# EasyEDA Pro project ProPrj_PW113_RF功放_2025-07-16.epro

# Schematic Schematic1
Board Name: Board1; Create Date: 2025-07-15; Page Name: P1; Project Name: PW113_RF功放; Schematic Name: Schematic1; Update Date: 2025-07-15; Company: 嘉立创EDA; Page Size: A4; Version: V1.0
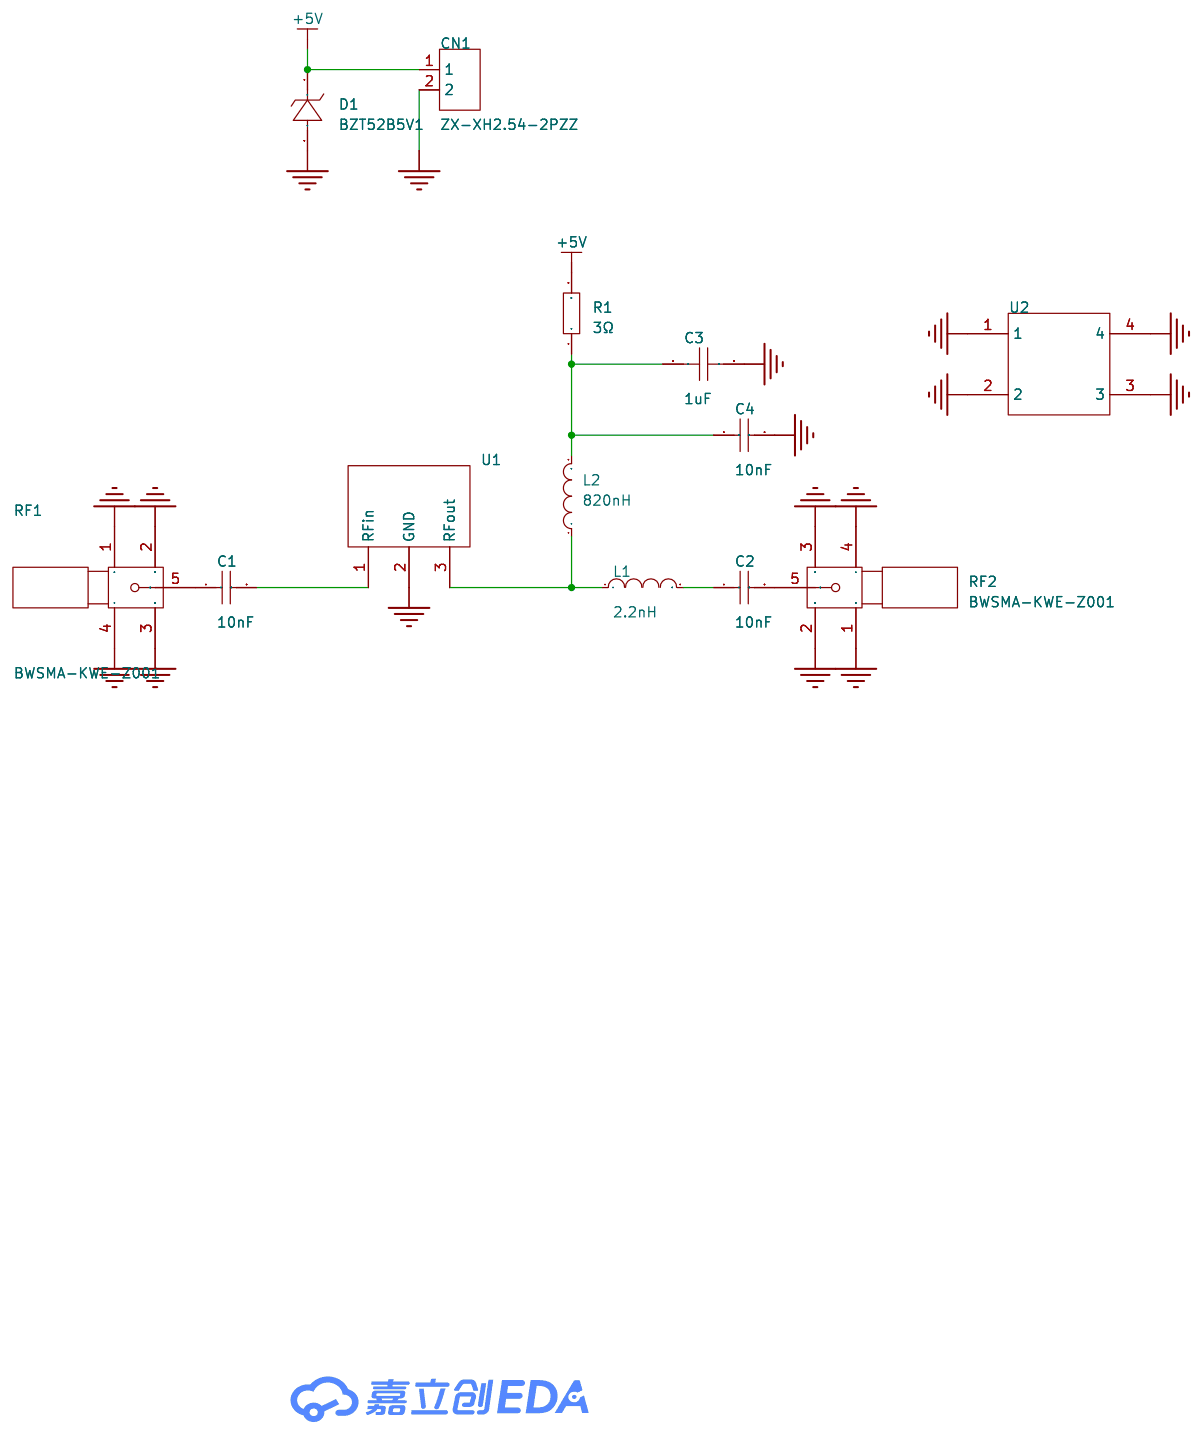
[diagram p0: schematic sheet]

## Parts
C1  10nF  [C0603]
C2  10nF  [C0603]
C3  1uF  [C0603]
C4  10nF  [C0603]
CN1  ZX-XH2.54-2PZZ  [CONN-TH_2P-P2.50_HX25003-2A]
D1  BZT52B5V1  [SOD-123_L2.7-W1.6-LS3.7-RD]
L1  2.2nH  [IND-SMD_L1.6-W1.0]
L2  820nH  [L0603]
R1  3Ω  [R0805]
RF1  BWSMA-KWE-Z001  [SMA-TH_BWSMA-KWE-Z001]
RF2  BWSMA-KWE-Z001  [SMA-TH_BWSMA-KWE-Z001]
U1  -  [PG-SOT-89-4_L4.5-W2.5-P1.50-LS4.2-TR]
U2  -  [22x17x6]

## Library data of the parts
C1 C2 C4 = 0603B103K500NT: 容值:10nF;精度:±10%;额定电压:50V;温度系数:X7R;; LCSC Part Name: 10nF ±10% 50V; Supplier Part: C57112; Manufacturer: FH(风华); Supplier Footprint: 0603; JLCPCB Part Class: 基础库; Datasheet: https://atta.szlcsc.com/upload/public/pdf/source/20200305/C486355_26A10D38EF8C2A5C37091D0039909270.pdf; Supplier: LCSC; Tolerance: ±10%; Voltage Rating: 50V; Temperature Coefficient: X7R
C3 = CL10A105KB8NNNC: 容值:1uF;精度:±10%;额定电压:50V;材质(温度系数):X5R;; LCSC Part Name: 1uF ±10% 50V; Supplier Part: C15849; Manufacturer: SAMSUNG(三星); Supplier Footprint: 0603; JLCPCB Part Class: 基础库; Datasheet: https://atta.szlcsc.com/upload/public/pdf/source/20160218/1457707763339.pdf; Supplier: LCSC; Tolerance: ±10%; Voltage Rated: 50V; Temperature Coefficient: X5R
CN1 = ZX-XH2.54-2PZZ: 插针结构:1x2P;间距:2.5mm;安装方式:直插;参考系列:XH;总PIN数:2P;排数:1;每排PIN数:2;行距:-;额定电流:3A;触头材质:黄铜;触头镀层:锡;工作温度:-25℃~+85℃;; LCSC Part Name: 1x2P 间距:2.5mm 直插 系列:XH; Supplier Part: C7429632; Manufacturer: Megastar(兆星); Supplier Footprint: 插件,P=2.5mm; JLCPCB Part Class: 扩展库; Datasheet: https://atta.szlcsc.com/upload/public/pdf/source/20230619/19BA6947230AA44A04D3EDD65E618FD0.pdf; Supplier: LCSC; Pins Structure: 1x2P; Pitch: 2.5mm; Mounting Type: 直插; Reference Series: XH; Number of Pins: 2P; Number of Rows: 1; Number of PINs Per Row: 2; Current Rating: 3A; Contact Material: 黄铜; Contact Plating: 锡; Operating Temperature: -25℃~+85℃; Voltage Rating: 250V; Plastic Material: PA66; Flame Retardant Rating: UL94V-0; Color: 白色; Z-Height of the Board: 7mm; X-Length of Bottom Edge on Board (Spacing Line): 7.5mm; Y-Width of Bottom Edge on Board: 5.9mm
D1 = BZT52B5V1_C19077393: 二极管配置:独立式;稳压值(标称值):5.1V;稳压值(范围):5V~5.2V;耗散功率(Pd):500mW;; Supplier Part: C19077393; Manufacturer: 宏嘉诚; Supplier Footprint: SOD-123; JLCPCB Part Class: 扩展库; Datasheet: https://atta.szlcsc.com/upload/public/pdf/source/20250106/AFD01FE5B0C707EDCEE558C585303F64.pdf; Supplier: LCSC; Diode Configuration: 独立式; Zener Voltage(Nom): 5.1V; Reverse Leakage Current (Ir): 2uA@2V; Zener Voltage(Range): 5V~5.2V; Pd - Power Dissipation(Pd): 500mW; Impedance(Zzt): 60Ω
L1 = CS0603-2N2J-S: 电感值:2.2nH;精度:±5%;额定电流:700mA;饱和电流(Isat):-;直流电阻(DCR):250mΩ;; LCSC Part Name: 2.2nH ±5%; Supplier Part: C280268; Manufacturer: Chilisin(奇力新); Supplier Footprint: 0603; JLCPCB Part Class: 扩展库; Datasheet: https://atta.szlcsc.com/upload/public/pdf/source/20181015/C280283_399428C6A5E6C348F06CEC39677678EB.pdf; Supplier: LCSC; Tolerance: ±5%; Current Rating: 700mA; DC Resistance(DCR): 250mΩ; Q @ Frequency: 13@250MHz; Frequency - Self Resonant: 12.5GHz
L2 = MLF1608DR82JTD25: 电感值:820nH;精度:±5%;额定电流:70mA;饱和电流(Isat):-;直流电阻(DCR):750mΩ;; LCSC Part Name: 820nH ±5%; Supplier Part: C404520; Manufacturer: TDK; Supplier Footprint: 0603; JLCPCB Part Class: 扩展库; Datasheet: https://atta.szlcsc.com/upload/public/pdf/source/20190315/C380006_40E8C92C81D7F1F4B5C2A9461469A58E.pdf; Supplier: LCSC; Tolerance: ±5%; Rated Current: 70mA; DC Resistance (DCR): 750mΩ; Q @ Freq: 15@25MHz; Frequency - Self Resonant: 130MHz; Ratings: AEC-Q200; Type: 叠层电感
R1 = 0805W8F300KT5E: 电阻类型:厚膜电阻;阻值:3Ω;精度:±1%;功率:125mW;工作电压:150V;温度系数:±400ppm/℃;; LCSC Part Name: 3Ω ±1% 125mW 厚膜电阻; Supplier Part: C17660; Manufacturer: UNI-ROYAL(厚声); Supplier Footprint: 0805; JLCPCB Part Class: 扩展库; Datasheet: https://atta.szlcsc.com/upload/public/pdf/source/20200306/C422600_1E6D84923E4A46A82E41ADD87F860B5C.pdf; Supplier: LCSC; Type: 厚膜电阻; Tolerance: ±1%; Power(Watts): 125mW; Voltage-Supply(Max): 150V; Temperature Coefficient: ±400ppm/℃; Operating Temperature: -55℃~+155℃
RF1 RF2 = BWSMA-KWE-Z001: 连接器类型:板端;接口类型:内孔;端口数量:1;接口直径:5.3mm;接口长度/高度:-;频率-最大值:-;射频系列:SMA;阻抗:50Ω;样式:弯头;触头材质:-;触头镀层:-;工作温度范围:-;焊接温度(最大值):-;; LCSC Part Name: 内孔 SMA 弯头; Supplier Part: C496551; Manufacturer: BAT WIRELESS(蝙蝠无线); Supplier Footprint: 插件; JLCPCB Part Class: 扩展库; Datasheet: https://atta.szlcsc.com/upload/public/pdf/source/20231017/997A8C2ADA7F8034A89BE1264F38CE52.pdf; Supplier: LCSC; Connector Type: 板端; Interface Type: 内孔; Number of Ports: 1; Interface Diameter: 5.3mm; RF Series: SMA; Impedance: 50Ω; Style: 弯头
U1 = PW113: 功放
U2 = 22x17x6

## Nets
+5V: CN1.1 D1.1(K) R1.2
GND: C3.2 C4.2 CN1.2 D1.2(A) RF1.1 RF1.2 RF1.3 RF1.4 RF2.1 RF2.2 RF2.3 RF2.4 U1.2(GND) U2.1 U2.2 U2.3 U2.4
Net-(C1-1): C1.1 RF1.5
Net-(C1-2): C1.2 U1.1(RFin)
Net-(C2-1): C2.1 L1.2
Net-(C2-2): C2.2 RF2.5
Net-(C3-1): C3.1 C4.1 L2.2 R1.1
Net-(L1-1): L1.1 L2.1 U1.3(RFout)

# Board PCB1
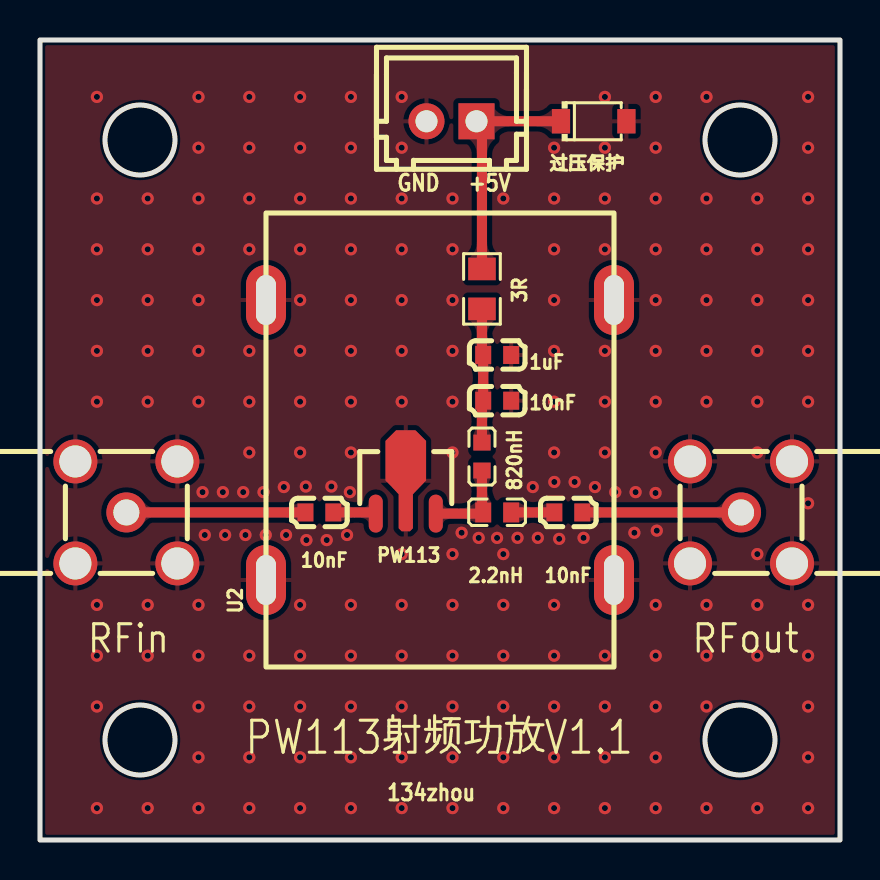
[diagram p1: board, top side]
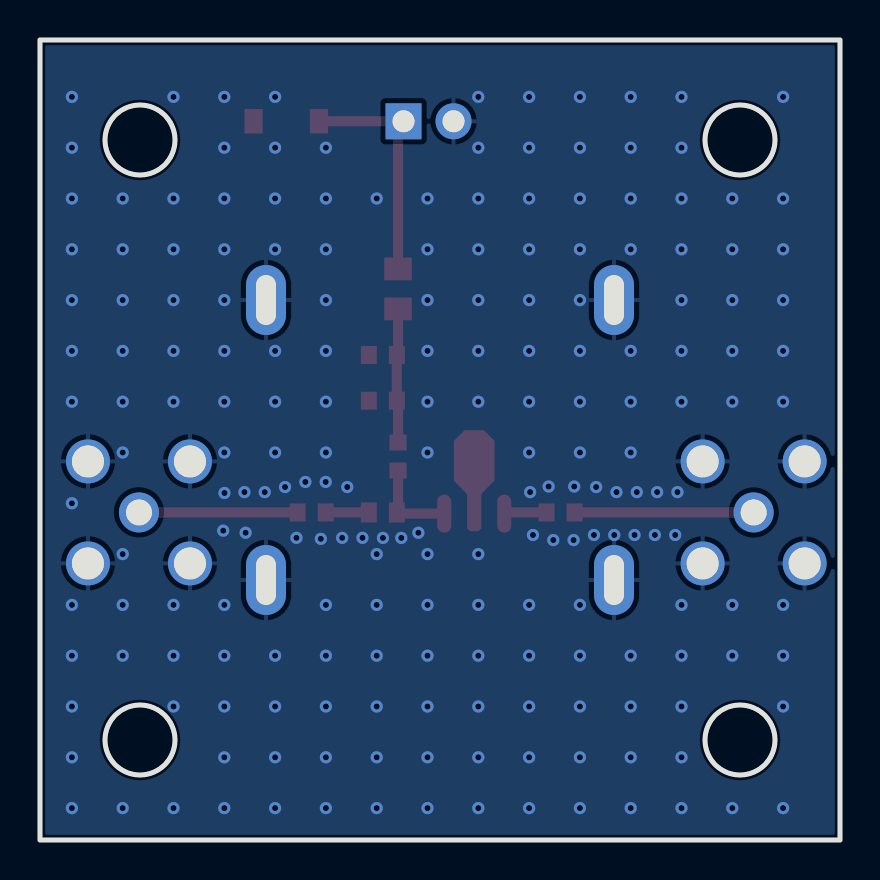
[diagram p2: board, bottom side, seen from below]

Outline 40 x 40 mm; copper layers: Top Layer, Bottom Layer. Coordinates in mm from the lower left corner of the outline.
Outline path: rectangle 0,40 40,0 ; circle c5,35 r1.75 ; circle c5,5 r1.75 ; circle c35,35 r1.75 ; circle c35,5 r1.75
Stack: Top Layer 0.035mm / Dielectric1 1.51mm FR4 er 4.5 / Bottom Layer 0.035mm

## Design rules (mm)
template: JLCPCB Capability(Two Layers Board)
spacing copperThickness1oz (default): track to track 0.102, other pairs 0.152 to 0.3
spacing copperThickness2oz: track to track 0.203, other pairs 0.152 to 0.3
track width copperThickness1oz (default): min 0.127, default 0.254, max 2.54
track width copperThickness2oz: min 0.203, default 0.254, max 2.54
differential pair differentialPair (default): width min 0.127, default 0.254, max 2.54; gap min 0.152, default 0.152
via viaSize (default): diameter min 0.5, default 0.61, max 10; hole min 0.3, default 0.305, max 6.3

## Placement (name value [footprint] x y rotation side)
1uF  1uF  [C0603]  22.86 24.25 0 top
2.2nH  2.2nH  [IND-SMD_L1.6-W1.0]  22.86 16.38 0 top
3R  3Ω  [R0805]  22.1 27.55 90 top
10nF  -  [C0603]  13.97 16.38 0 top
10nF#2  -  [C0603]  26.42 16.38 0 top
10nF#3  -  [C0603]  22.86 21.97 0 top
820nH  820nH  [L0603]  22.1 19.17 90 top
CN1  ZX-XH2.54-2PZZ  [CONN-TH_2P-P2.50_HX25003-2A]  20.57 35.94 180 top
PW113  -  [PG-SOT-89-4_L4.5-W2.5-P1.50-LS4.2-TR]  18.29 17.14 180 top
RFin  BWSMA-KWE-Z001  [SMA-TH_BWSMA-KWE-Z001]  4.32 16.38 180 top
RFout  BWSMA-KWE-Z001  [SMA-TH_BWSMA-KWE-Z001]  35.05 16.38 0 top
U2  -  [22x17x6]  20 20 90 top
过压保护  BZT52B5V1  [SOD-123_L2.7-W1.6-LS3.7-RD]  27.69 35.94 0 top

## Footprints (pads in the part's own frame, mm; a bottom-side part is the same pattern mirrored in y, then rotated)
22x17x6
  oval 3.5x2 hole 2.5x1: 1(-7,-8.7) 2(7,-8.7) 3(7,8.7) 4(-7,8.7)
C0603
  rect 0.8x0.9 smd: 1(-0.7,0) 2(0.7,0)
CONN-TH_2P-P2.50_HX25003-2A
  rect 1.8x1.8 hole 1.1: 1(-1.25,0)
  round 1.8 hole 1.1: 2(1.25,0)
IND-SMD_L1.6-W1.0
  rect 0.8x1 smd: 1(-0.7,0) 2(0.7,0)
L0603
  rect 0.8x0.864 smd: 1(-0.7,0) 2(0.7,0)
PG-SOT-89-4_L4.5-W2.5-P1.50-LS4.2-TR
  oval 0.7x1.9 smd: 1(1.501,0.82) 3(-1.501,0.82)
  custom 2.032x5.055 smd: 2(-0.001,-0.82)
R0805
  rect 1.133x1.377 smd: 1(-1,0) 2(1,0)
SMA-TH_BWSMA-KWE-Z001
  round 2.2 hole 1.6: 1(-2.55,-2.55) 2(-2.55,2.55) 3(2.55,2.55) 4(2.55,-2.55)
  round 2 hole 1.3: 5(0,0)
SOD-123_L2.7-W1.6-LS3.7-RD
  rect 0.91x1.22 smd: 1(-1.635,0) 2(1.635,0)

## Nets
+5V: 3R.2 CN1.1 过压保护.1
GND: 1uF.2 10nF#3.2 CN1.2 PW113.2 RFin.1 RFin.2 RFin.3 RFin.4 RFout.1 RFout.2 RFout.3 RFout.4 U2.1 U2.2 U2.3 U2.4 过压保护.2
$1N333: 10nF.2 PW113.1
$1N443: 2.2nH.2 10nF#2.1
$1N483: 2.2nH.1 820nH.1 PW113.3
$1N524: 1uF.1 3R.1 10nF#3.1 820nH.2
$1N920: 10nF.1 RFin.5
$1N974: 10nF#2.2 RFout.5

## Via types
v1: diameter 0.61, hole 0.305, Top Layer to Bottom Layer, 200 vias

## Routing (per net, layer and track width the routed paths; a pad name or vN(x,y) marks a point on that pad's centre or on a via; arc(x,y) is an arc through that point)
+5V: length 11.7
  Top Layer w0.508: 3R.2 22.1,35.66 CN1.1 过压保护.1
GND:
  vias: v1(2.84,37.16) v1(2.84,32.08) v1(2.84,29.53) v1(2.84,27) v1(2.84,24.45) v1(2.84,21.92) v1(2.84,11.75) v1(2.84,9.22) v1(2.84,6.67) v1(2.84,1.59) v1(5.38,32.08) v1(5.38,29.53) v1(5.38,27) v1(5.38,24.45) v1(5.38,21.92) v1(5.38,11.75) v1(5.38,9.22) v1(5.38,1.59) v1(7.93,37.16) v1(7.93,34.61) v1(7.93,32.08) v1(7.93,29.53) v1(7.93,27) v1(7.93,24.45) v1(7.93,21.92) v1(7.93,11.75) v1(7.93,9.22) v1(7.93,6.67) v1(7.93,4.14) v1(7.93,1.59) v1(8.13,17.39) v1(8.24,15.25) v1(9.14,17.39) v1(9.26,15.25) v1(10.16,17.39) v1(10.27,15.25) v1(10.47,37.16) v1(10.47,34.61) v1(10.47,32.08) v1(10.47,29.53) v1(10.47,24.45) v1(10.47,21.92) v1(10.47,19.38) v1(10.47,9.22) v1(10.47,6.67) v1(10.47,4.14) v1(10.47,1.59) v1(11.18,17.39) v1(11.29,15.25) v1(12.19,17.65) v1(12.3,15.25) v1(13,37.16) v1(13,34.61) v1(13,32.08) v1(13,29.53) v1(13,27) v1(13,24.45) v1(13,21.92) v1(13,19.38) v1(13,11.75) v1(13,9.22) v1(13,6.67) v1(13,4.14) v1(13,1.59) v1(13.29,17.67) v1(13.32,15) v1(14.34,15) v1(14.57,17.67) v1(15.35,15.25) v1(15.54,37.16) v1(15.54,34.61) v1(15.54,32.08) v1(15.54,29.53) v1(15.54,27) v1(15.54,24.45) v1(15.54,21.92) v1(15.54,19.38) v1(15.49,17.39) v1(15.54,11.75) v1(15.54,9.22) v1(15.54,6.67) v1(15.54,4.14) v1(15.54,1.59) v1(18.09,37.16) v1(18.09,34.61) v1(18.09,32.08) v1(18.09,29.53) v1(18.09,27) v1(18.09,24.45) v1(18.09,21.92) v1(18.09,14.3) v1(18.09,11.75) v1(18.09,9.22) v1(18.09,6.67) v1(18.09,4.14) v1(18.09,1.59) v1(20.62,32.08) v1(20.62,29.53) v1(20.62,27) v1(20.62,24.45) v1(20.62,21.92) v1(20.62,19.38) v1(20.62,14.3) v1(20.62,11.75) v1(20.62,9.22) v1(20.62,6.67) v1(20.62,4.14) v1(20.62,1.59) v1(21.08,15.36) v1(21.94,15.1) v1(22.85,15.1) v1(23.16,32.08) v1(23.16,14.3) v1(23.16,11.75) v1(23.16,9.22) v1(23.16,6.67) v1(23.16,4.14) v1(23.16,1.59) v1(23.88,15.11) v1(24.64,17.65) v1(24.89,15.11) v1(25.71,34.61) v1(25.71,32.08) v1(25.71,29.53) v1(25.71,27) v1(25.71,24.45) v1(25.71,21.92) v1(25.71,19.38) v1(25.72,17.9) v1(25.71,11.75) v1(25.71,9.22) v1(25.71,6.67) v1(25.71,4.14) v1(25.71,1.59) v1(25.96,15.06) v1(26.73,17.9) v1(27.18,15.11) v1(27.75,17.65) v1(28.25,37.16) v1(28.25,34.61) v1(28.25,32.08) v1(28.25,29.53) v1(28.25,24.45) v1(28.25,21.92) v1(28.25,19.38) v1(28.25,9.22) v1(28.25,6.67) v1(28.25,4.14) v1(28.25,1.59) v1(28.76,17.39) v1(29.72,15.36) v1(29.78,17.39) v1(30.78,37.16) v1(30.78,34.61) v1(30.78,32.08) v1(30.78,29.53) v1(30.78,27) v1(30.78,24.45) v1(30.78,21.92) v1(30.78,19.38) v1(30.78,17.35) v1(30.84,15.47) v1(30.78,11.75) v1(30.78,9.22) v1(30.78,6.67) v1(30.78,4.14) v1(30.78,1.59) v1(33.32,37.16) v1(33.32,32.08) v1(33.32,29.53) v1(33.32,27) v1(33.32,24.45) v1(33.32,21.92) v1(33.32,11.75) v1(33.32,9.22) v1(33.32,6.67) v1(33.32,1.59) v1(35.87,32.08) v1(35.87,29.53) v1(35.87,27) v1(35.87,24.45) v1(35.87,21.92) v1(35.87,19.38) v1(35.87,14.3) v1(35.87,11.75) v1(35.87,9.22) v1(35.87,1.59) v1(38.41,37.16) v1(38.41,34.61) v1(38.41,32.08) v1(38.41,29.53) v1(38.41,27) v1(38.41,24.45) v1(38.41,21.92) v1(38.41,16.83) v1(38.41,11.75) v1(38.41,9.22) v1(38.41,6.67) v1(38.41,4.14) v1(38.41,1.59)
$1N333: length 2.1
  Top Layer w0.508: 10nF.2 16.73,16.38 PW113.1
$1N443: length 2.2
  Top Layer w0.508: 2.2nH.2 10nF#2.1
$1N483: length 4.5
  Top Layer w0.508: 820nH.1 22.1,16.44 2.2nH.1 22.1,16.32 19.79,16.32
$1N524: length 6.7
  Top Layer w0.508: 820nH.2 22.1,21.9 10nF#3.1 1uF.1 22.1,24.31 3R.1
$1N920: length 9
  Top Layer w0.508: RFin.5 10nF.1
$1N974: length 7.9
  Top Layer w0.508: 10nF#2.2 RFout.5

## Copper pours and planes (outline as drawn; the poured copper is in the pictures)
GND on Top Layer: -5.33,43.81 42.67,43.81 42.67,-2.93 -5.33,-2.93
GND on Bottom Layer: -1.52,45.59 44.7,45.59 44.7,-5.72 -1.52,-5.72

Small or netless copper shapes (teardrops, artwork), in the pictures only: 22 on Top Layer

## Text on the board
Top Silkscreen Layer: 134zhou | GND | +5V | PW113射频功放V1.1
